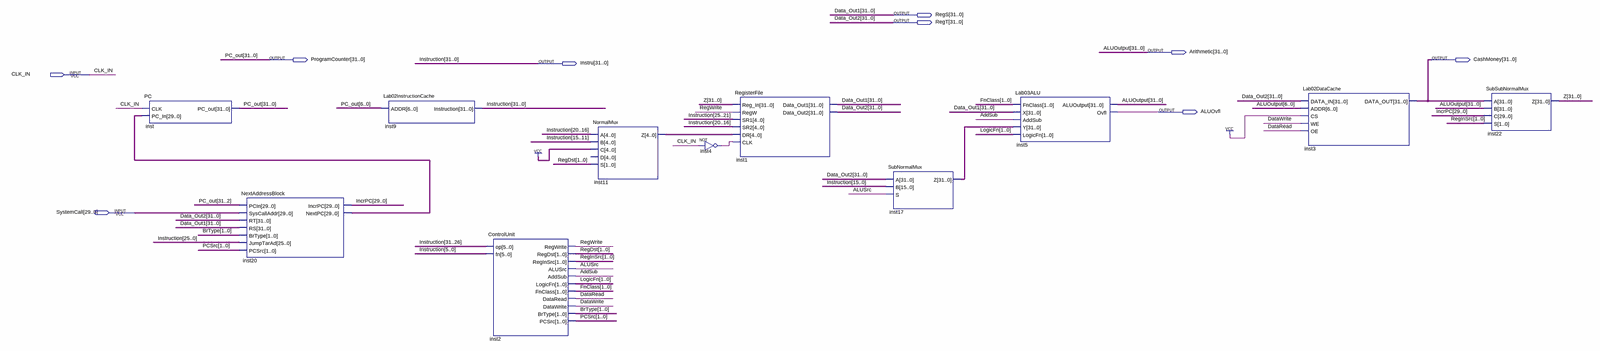
[diagram p0: schematic sheet, whole]
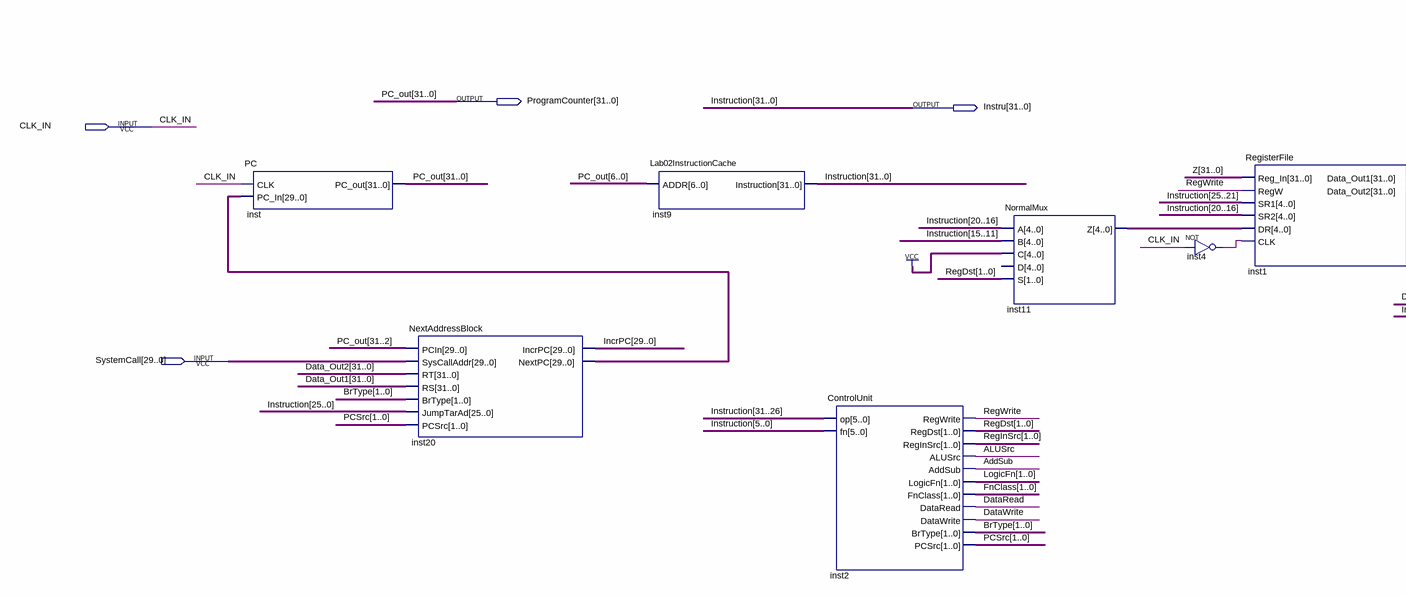
[diagram p1: schematic sheet, left part]
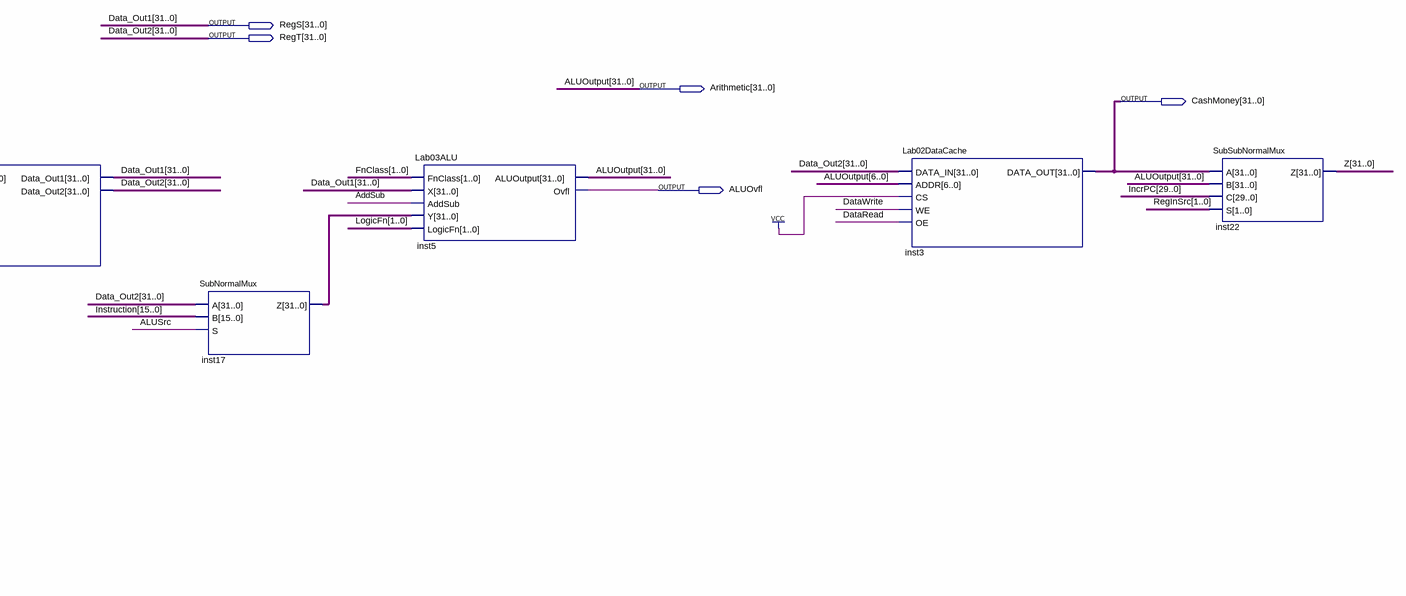
[diagram p2: schematic sheet, right part]
// Quartus schematic MainFile.bdf as structural Verilog: 11 symbols, 9 pins
module MainFile (
  input  CLK_IN,
  input  [29:0] SystemCall,
  output [31:0] RegS,
  output [31:0] RegT,
  output [31:0] Arithmetic,
  output [31:0] ProgramCounter,
  output [31:0] CashMoney,
  output [31:0] Instru,
  output ALUOvfl
);

  wire AddSub, ALUSrc, DataRead, DataWrite, inst4_out, RegWrite;
  wire [1:0] BrType, FnClass, LogicFn, PCSrc, RegDst, RegInSrc;
  wire [4:0] inst11_z;
  wire [29:0] IncrPC, inst20_nextpc;
  wire [31:0] inst17_z, Z;

  PC inst (.CLK(CLK_IN), .PC_In(inst20_nextpc), .PC_out(ProgramCounter));
  NextAddressBlock inst20 (
    .PCIn(ProgramCounter[31:2]), .SysCallAddr(SystemCall), .RT(RegT), .RS(RegS), .BrType(BrType),
    .JumpTarAd(Instru[25:0]), .PCSrc(PCSrc), .IncrPC(IncrPC), .NextPC(inst20_nextpc));
  Lab02InstructionCache inst9 (.ADDR(ProgramCounter[6:0]), .Instruction(Instru));
  ControlUnit inst2 (
    .op(Instru[31:26]), .fn(Instru[5:0]), .RegWrite(RegWrite), .RegDst(RegDst), .RegInSrc(RegInSrc),
    .ALUSrc(ALUSrc), .AddSub(AddSub), .LogicFn(LogicFn), .FnClass(FnClass), .DataRead(DataRead),
    .DataWrite(DataWrite), .BrType(BrType), .PCSrc(PCSrc));
  NormalMux inst11 (.A(Instru[20:16]), .B(Instru[15:11]), .C({5{1'b1}}), .S(RegDst), .Z(inst11_z));  // open: D
  not inst4 (inst4_out, CLK_IN);
  RegisterFile inst1 (
    .Reg_In(Z), .RegW(RegWrite), .SR1(Instru[25:21]), .SR2(Instru[20:16]), .DR(inst11_z), .CLK(inst4_out),
    .Data_Out1(RegS), .Data_Out2(RegT));
  SubNormalMux inst17 (.A(RegT), .B(Instru[15:0]), .S(ALUSrc), .Z(inst17_z));
  Lab03ALU inst5 (
    .FnClass(FnClass), .X(RegS), .AddSub(AddSub), .Y(inst17_z), .LogicFn(LogicFn), .ALUOutput(Arithmetic),
    .Ovfl(ALUOvfl));
  Lab02DataCache inst3 (
    .DATA_IN(RegT), .ADDR(Arithmetic[6:0]), .CS(1'b1), .WE(DataWrite), .OE(DataRead), .DATA_OUT(CashMoney));
  SubSubNormalMux inst22 (.A(CashMoney), .B(Arithmetic), .C(IncrPC), .S(RegInSrc), .Z(Z));

  // Other names for the same wires on the sheet: ALUOutput[31:0] = Arithmetic; Data_Out1[31:0] = RegS;
  //   Data_Out2[31:0] = RegT; Instruction[31:0] = Instru; PC_out[31:0] = ProgramCounter
endmodule
